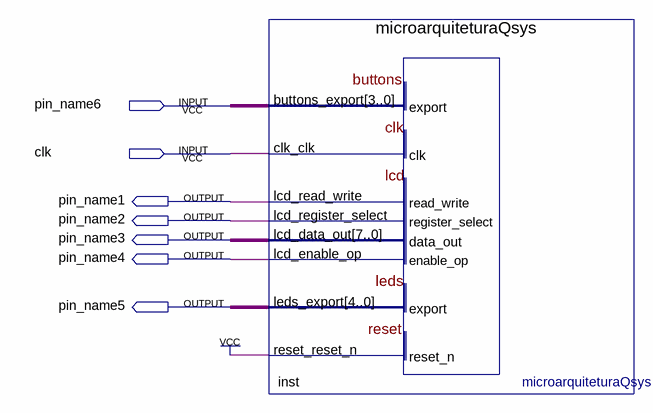
[diagram p0: schematic sheet]
// Quartus schematic microarquitetura.bdf as structural Verilog: 1 symbols, 7 pins
module microarquitetura (
  input  pin_name6,
  input  clk,
  output pin_name1,
  output pin_name2,
  output pin_name3,
  output pin_name4,
  output pin_name5
);

  wire [3:0] undriven;
  wire [4:0] inst_leds_export;
  wire [7:0] inst_lcd_data_out;

  microarquiteturaQsys inst (
    .buttons_export(undriven), .clk_clk(clk), .reset_reset_n(1'b1), .lcd_read_write(pin_name1),
    .lcd_register_select(pin_name2), .lcd_data_out(inst_lcd_data_out), .lcd_enable_op(pin_name4),
    .leds_export(inst_leds_export));
endmodule
